# Altium schematic sheet P5650.925_PCB Features.SchDoc
size A3; SheetNumber: 3; SheetTotal: 3
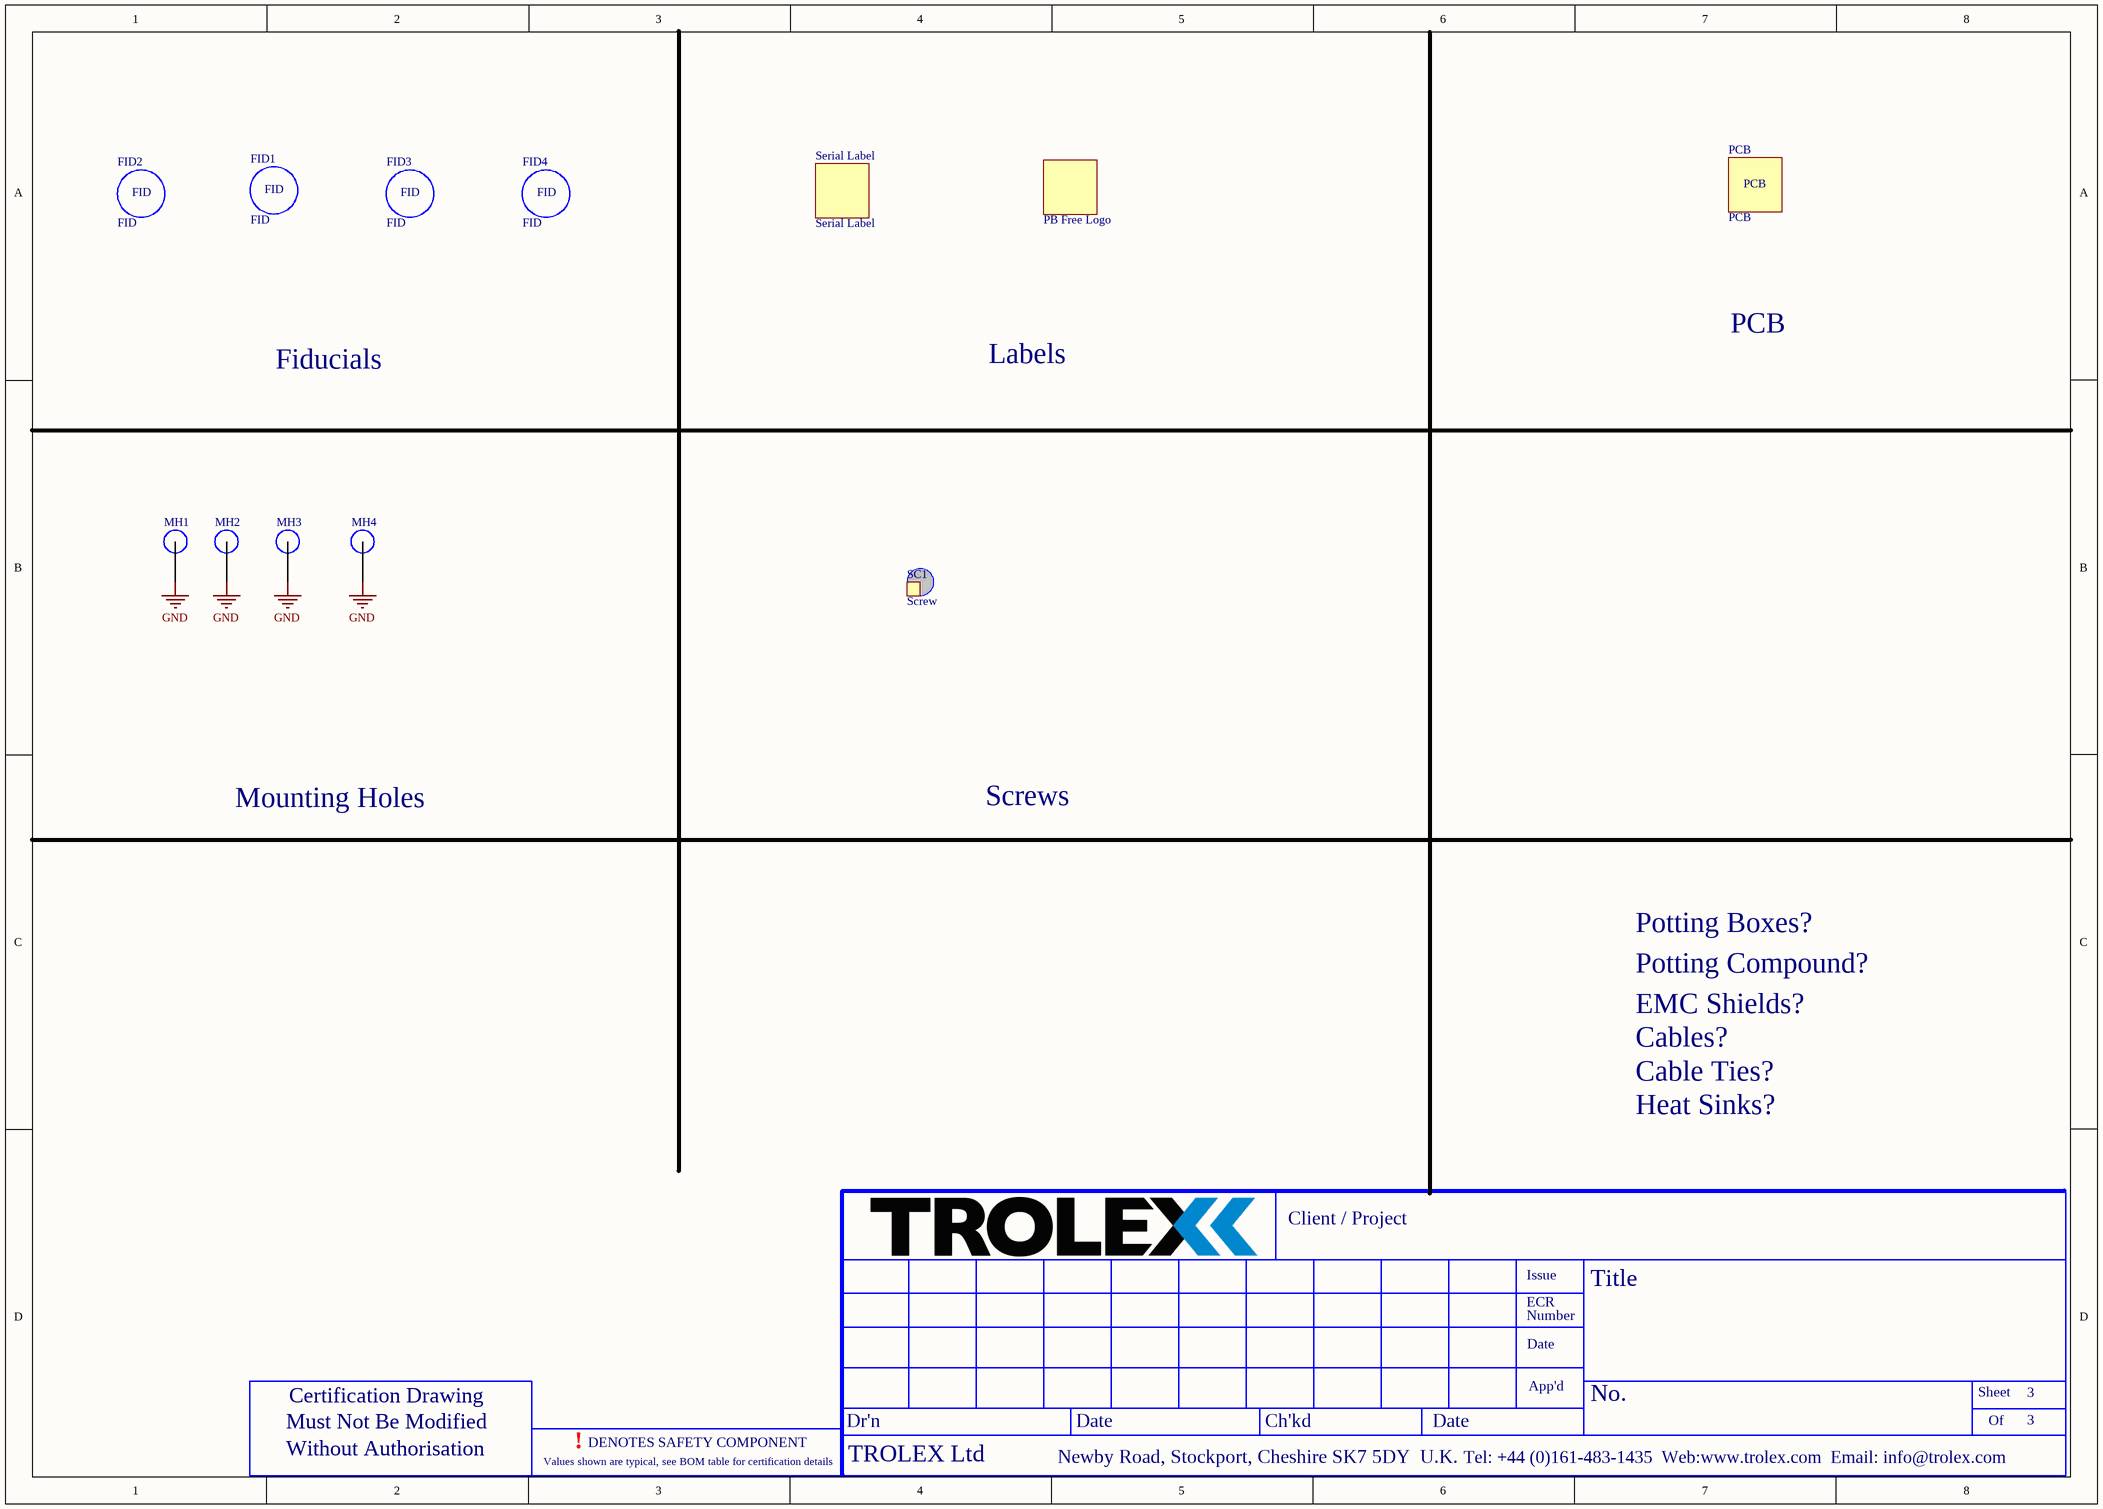
[diagram p0: P5650.925_PCB Features.SchDoc]

## Parts
FID1  FID  [FID]  (no BOM)
FID2  FID  [FID]  (no BOM)
FID3  FID  [FID]  (no BOM)
FID4  FID  [FID]  (no BOM)
MH1  Mounting Hole  [Mounting Hole M3]  (value not drawn)  (no BOM)
MH2  Mounting Hole  [Mounting Hole M3]  (value not drawn)  (no BOM)
MH3  Mounting Hole  [Mounting Hole M3]  (value not drawn)  (no BOM)
MH4  Mounting Hole  [Mounting Hole M3]  (value not drawn)  (no BOM)
PB_Free  PB Free Logo  [PB Free Logo-Footprint-1]  (no BOM)
PCB  PCB  (mechanical)
SC1  Screw  (mechanical)
Serial_Label  Serial Label  [Serial Label 19 x 6]  (no BOM)

## Nets
GND: MH1.1 MH2.1 MH3.1 MH4.1

## Notes on the sheet
- Fiducials
- Labels
- PCB
- Mounting Holes
- Screws
- Potting Boxes?
- Potting Compound?
- EMC Shields?
- Cables?
- Cable Ties?
- Heat Sinks?
- Client / Project
- Issue
- ECR
- Number
- Title
- Date
- App'd
- Sheet
- Must Not Be Modified
- Without Authorisation
- Certification Drawing
- Values shown are typical, see BOM table for certification details
- !
- DENOTES SAFETY COMPONENT
- Dr'n
- TROLEX Ltd
- Newby Road, Stockport, Cheshire SK7 5DY  U.K.
- Ch'kd
- Tel: +44 (0)161-483-1435  Web:www.trolex.com  Email: info@trolex.com
- No.
- Of

## Library data of the parts
FID1-FID4 = CMP-054-000000-1: Part Number: S*; 3D Lib Path: K:\Altium\Trolex Library June 2015\Trolex 3D Components June 2015; Source: Mechanical.SchLib; Category: Connectors; Symbol ID: FID; Created By: BTS; Created Date: 04/06/2015; Design Item ID: FID; Symbol Path: K:\Altium\Trolex Library June 2015\Trolex Schematic Library Imperial\Mechanical.SchLib
MH1-MH4 = CMP-054-000002-1: Part Number: S*; Symbol ID: XSUP015AY PRESSURE SENSOR; 3D Lib Path: K:\Altium\Trolex Library June 2015\Trolex 3D Components June 2015; Created Date: 04/06/2015; Design Item ID: Mounting Hole; Category: Connectors; Source: Mechanical.SchLib; Symbol Path: K:\Altium\Trolex Library June 2015\Trolex Schematic Library Imperial\Mechanical.SchLib; Created By: BTS
PB_Free = CMP-00028-00007-3: Design Item ID: PB Free; Source: Mechanical.SchLib
PCB = CMP-059-000000-1: Part Number: Pxxxx.xx; 3D Lib Path: K:\Altium\Trolex Library June 2015\Trolex 3D Components June 2015; Category: PCB; Design Item ID: PCB; Source: Mechanical.SchLib; Created By: BTS; Created Date: 27/04/2018
SC1 = CMP-054-000001-1: Part Number: S*; Symbol ID: XSUP015AY PRESSURE SENSOR; 3D Lib Path: K:\Altium\Trolex Library June 2015\Trolex 3D Components June 2015; Source: Mechanical.SchLib; Created By: BTS; Design Item ID: Screw; Created Date: 04/06/2015; Symbol Path: K:\Altium\Trolex Library June 2015\Trolex Schematic Library Imperial\Mechanical.SchLib; Category: Connectors
Serial_Label = CMP-059-000023-2: Serial Label 19 x6; Design Item ID: Serial Label; Source: Mechanical.SchLib